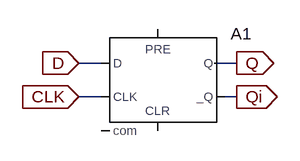
[diagram p0: schematic dff2.asc]
dff2.asc, the LTspice schematic file:
Version 4
SHEET 1 880 680
WIRE 128 128 96 128
WIRE 320 128 288 128
WIRE 128 176 96 176
WIRE 320 176 304 176
FLAG 96 128 D
IOPIN 96 128 In
FLAG 96 176 CLK
IOPIN 96 176 In
FLAG 320 128 Q
IOPIN 320 128 Out
FLAG 320 176 Qi
IOPIN 320 176 Out
SYMBOL Digital\\dflop 208 80 R0
SYMATTR InstName A1
SYMATTR SpiceLine vhigh=5 tau=100p

The netlist it stands for:
* dff2.asc
A1 D 0 CLK 0 0 Qi Q 0 DFLOP vhigh=5 tau=100p
.backanno
.end